# Altium schematic sheet FUN.SchDoc
size A4
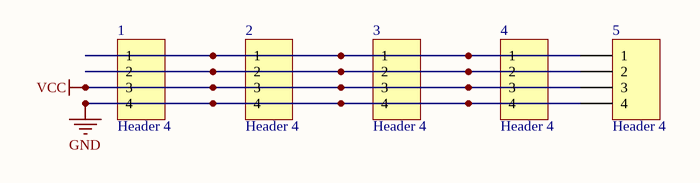
[diagram p0: FUN.SchDoc]

## Parts
1  Header 4  [HDR1X4]
2  Header 4  [HDR1X4]
3  Header 4  [HDR1X4]
4  Header 4  [HDR1X4]
5  Header 4  [HDR1X4]

## Nets
GND: 1.4 2.4 3.4 4.4 5.4
VCC: 1.3 2.3 3.3 4.3 5.3
Net1_1: 1.1 2.1 3.1 4.1 5.1
Net1_2: 1.2 2.2 3.2 4.2 5.2

## Library data of the parts
1-5 = Header 4: Header, 4-Pin; LatestRevisionDate: 17-Jul-2002; LatestRevisionNote: Re-released for DXP Platform.; Publisher: Altium Limited